# EAGLE design pcb (EAGLE 7.2.0)
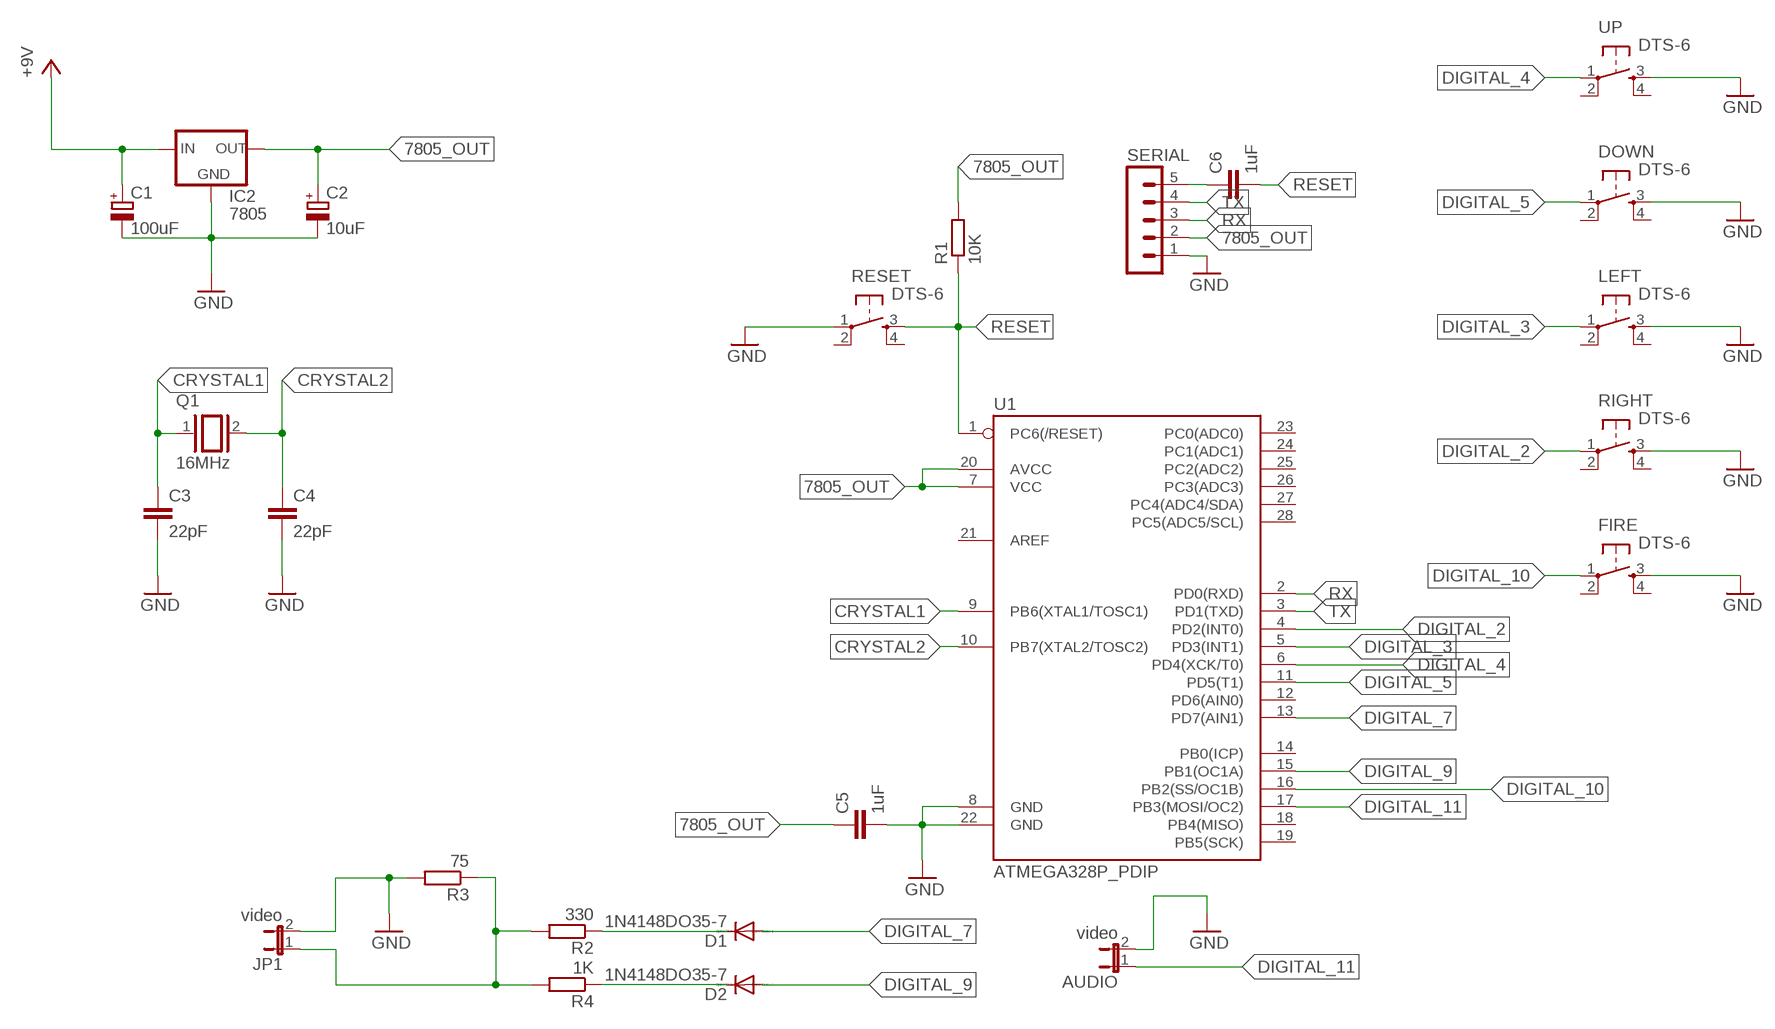
[diagram p0: schematic, sheet 1]

## Parts
AUDIO  video  JP1E  [JP1]
C1  100uF  CPOL-EUE2,5-6E  [E2,5-6E]
C2  10uF  CPOL-EUE2,5-6E  [E2,5-6E]
C3  22pF  C2,5-3  [C2.5-3]
C4  22pF  C2,5-3  [C2.5-3]
C5  1uF  C2,5-3  [C2.5-3]
C6  1uF  C2,5-3  [C2.5-3]
D1  1N4148DO35-7  [DO35-7]
D2  1N4148DO35-7  [DO35-7]
DOWN  DTS-6  [DTS-6]
FIRE  DTS-6  [DTS-6]
IC2  7805  78MXXL  [78MXXL]
JP1  video  JP1E  [JP1]
LEFT  DTS-6  [DTS-6]
Q1  16MHz  XTAL/S  [QS]
R1  10K  R-EU_0204/5  [0204/5]
R2  330  R-EU_0204/5  [0204/5]
R3  75  R-EU_0204/5  [0204/5]
R4  1K  R-EU_0204/5  [0204/5]
RESET  DTS-6  [DTS-6]
RIGHT  DTS-6  [DTS-6]
SERIAL  MA05-1  [MA05-1]
U1  ATMEGA328P_PDIP  [DIL28-3]
UP  DTS-6  [DTS-6]

## Nets
7805_OUT: C2.+ C5.1 IC2.OUT R1.2 SERIAL.2 U1.7(VCC) U1.20(AVCC)
CRYSTAL1: C3.1 Q1.1 U1.9(PB6(XTAL1/TOSC1))
CRYSTAL2: C4.1 Q1.2 U1.10(PB7(XTAL2/TOSC2))
DIGITAL_2: RIGHT.1 U1.4(PD2(INT0))
DIGITAL_3: LEFT.1 U1.5(PD3(INT1))
DIGITAL_4: U1.6(PD4(XCK/T0)) UP.1
DIGITAL_5: DOWN.1 U1.11(PD5(T1))
DIGITAL_7: D1.A U1.13(PD7(AIN1))
DIGITAL_9: D2.A U1.15(PB1(OC1A))
DIGITAL_10: FIRE.1 U1.16(PB2(SS/OC1B))
DIGITAL_11: AUDIO.1 U1.17(PB3(MOSI/OC2))
GND: AUDIO.2 C1.- C2.- C3.2 C4.2 C5.2 DOWN.3 FIRE.3 IC2.GND JP1.2 LEFT.3 R3.2 RESET.1 RIGHT.3 SERIAL.1 U1.8(GND) U1.22(GND) UP.3
N$2: D1.C R2.1
N$3: D2.C R4.1
N$4: JP1.1 R2.2 R3.1 R4.2
N$8: C6.1 SERIAL.5
RESET: C6.2 R1.1 RESET.3 U1.1(PC6(/RESET))
RX: SERIAL.3 U1.2(PD0(RXD))
TX: SERIAL.4 U1.3(PD1(TXD))
VCC: C1.+ IC2.IN ; supply symbol labelled +9V
Unconnected: DOWN.2 DOWN.4 FIRE.2 FIRE.4 LEFT.2 LEFT.4 RESET.2 RESET.4 RIGHT.2 RIGHT.4 U1.12(PD6(AIN0)) U1.14(PB0(ICP)) U1.18(PB4(MISO)) U1.19(PB5(SCK)) U1.21(AREF) U1.23(PC0(ADC0)) U1.24(PC1(ADC1)) U1.25(PC2(ADC2)) U1.26(PC3(ADC3)) U1.27(PC4(ADC4/SDA)) U1.28(PC5(ADC5/SCL)) UP.2 UP.4

## Library data of the parts
AUDIO JP1 = jumper:JP1E: JUMPER
C1 C2 = rcl:CPOL-EU: POLARIZED CAPACITOR, European symbol
C3-C6 = capacitor-wima:C: CAPACITOR naming: grid - package width
D1 D2 = diode:1N4148: DIODE high speed (Philips)
DOWN FIRE LEFT RESET RIGHT UP = switch-tact:DTS-6
IC2 = v-reg:78MXXL: VOLTAGE REGULATOR
Q1 = special:XTAL/S: CRYSTAL
R1-R4 = resistor:R-EU_: RESISTOR, European symbol
SERIAL = con-lstb:MA05-1: PIN HEADER; OC_FARNELL: unknown; OC_NEWARK: unknown
U1 = SparkFun-DigitalIC:ATMEGA328P_PDIP: uC used in the Arduino 32kb flash, 1k EEPROM, 2k SRAM This is the through-hole version of this chip.

## Board
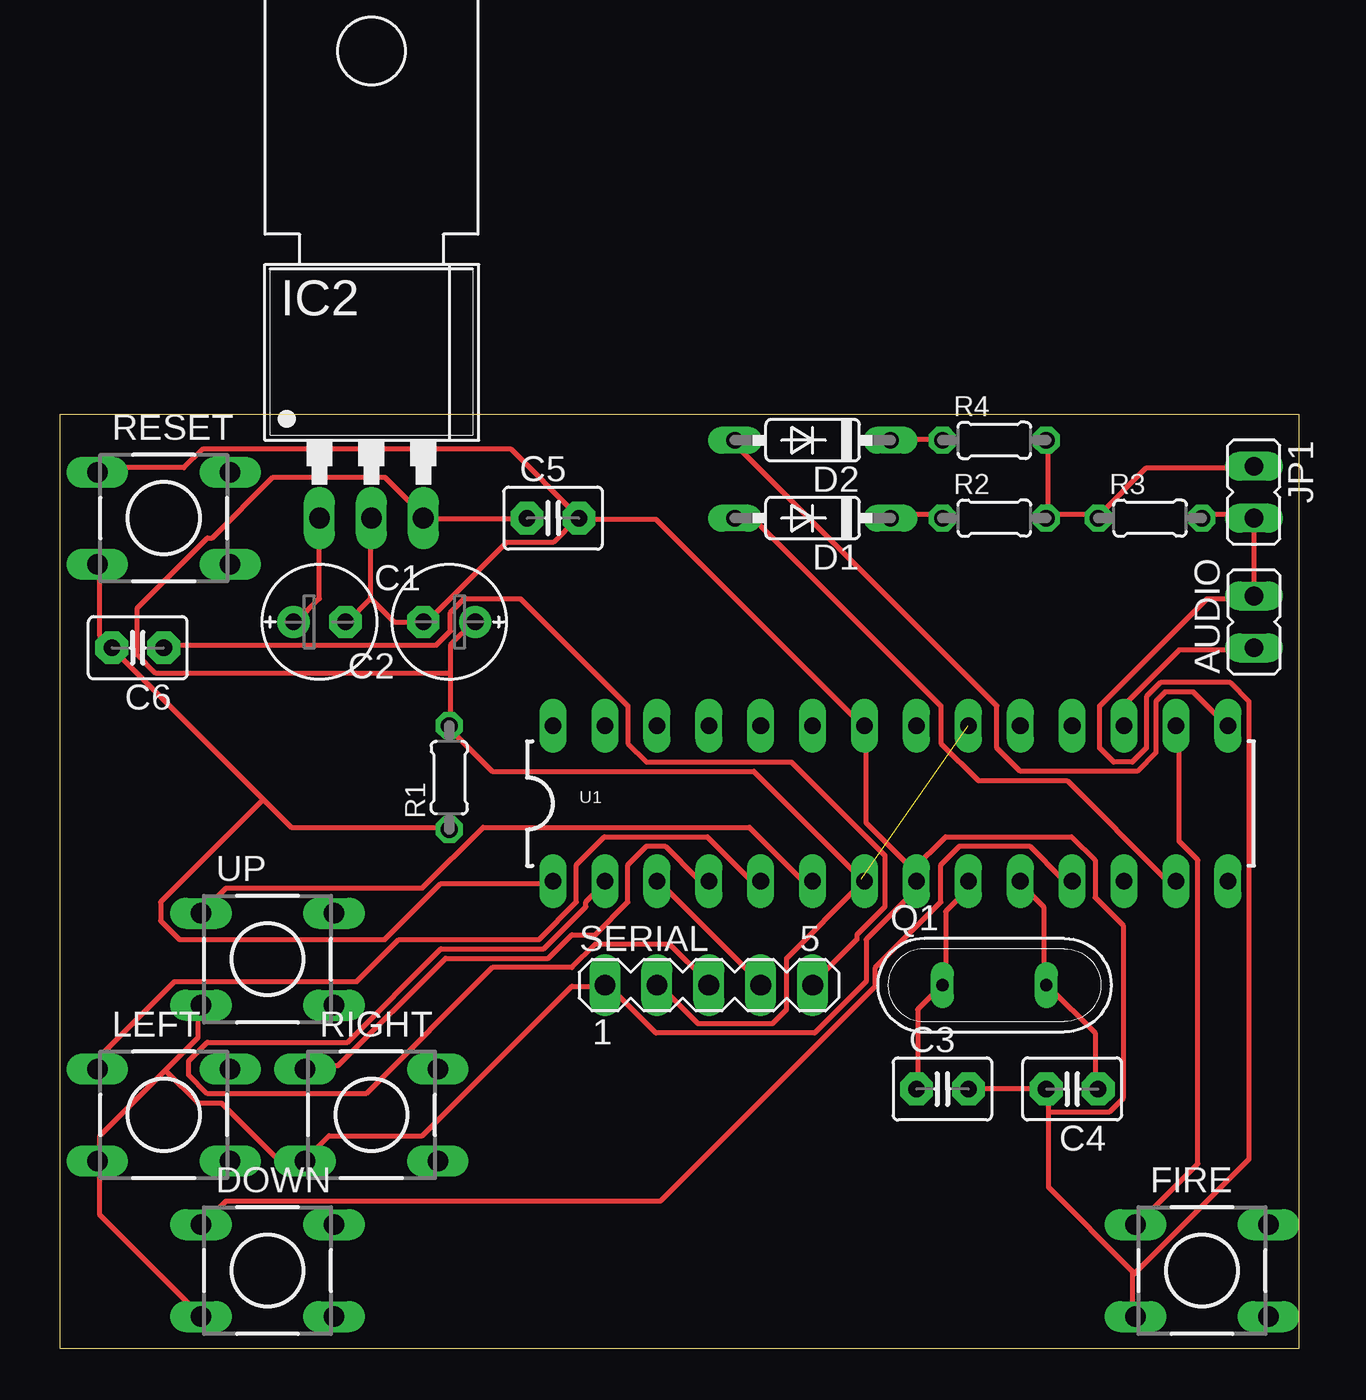
[diagram p1: board, top side]

Size 60.63 x 45.71 mm. Coordinates in mm from the lower left corner, seen from the top.
Outline: 0,0 60.63,0 60.63,45.71 0,45.71 0,0
Copper layers (1*16): Top 0.035mm / dielectric 1.5mm / Bottom 0.035mm
Design rules "default": minimum track width 10mil, minimum drill 24mil, track to track 8mil, track to pad 8mil, pad to pad 8mil, via to via 8mil, smd to smd 8mil, copper to edge 40mil, drill to drill 8mil, minimum pad ring 10mil, minimum via ring 8mil, stop-mask expansion 4mil, vias tented up to drill 0mil, thermal gap 10mil

### Footprints (pad centres in the part's own frame; a part is rotated, then mirrored left to right if it is on the bottom)
JP1 = drill 0.914 long: 1 0,-1.27; 2 0,1.27
E2,5-6E = drill 0.813 pad 1.575: + -1.27,0 | drill 0.813 pad 1.575 octagon: - 1.27,0
C2.5-3 = drill 0.813 pad 1.6 octagon: 1 -1.27,0; 2 1.27,0
DO35-7 = drill 0.813 long: A 3.81,0; C -3.81,0
DTS-6 = drill 1 long: 1 -3.25,2.25; 2 3.25,2.25; 3 -3.25,-2.25; 4 3.25,-2.25
78MXXL = drill 1.016 long: GND 0,-5.08; IN -2.54,-5.08; OUT 2.54,-5.08 | hole 3.302: 0,17.78
QS = drill 0.61 long: 1 -2.54,0; 2 2.54,0
0204/5 = drill 0.813 octagon: 1 -2.54,0; 2 2.54,0
MA05-1 = drill 1.016 long: 1 -5.08,0; 2 -2.54,0; 3 0,0; 4 2.54,0; 5 5.08,0
DIL28-3 = drill 0.813 long: 1 -16.51,-3.81; 2 -13.97,-3.81; 3 -11.43,-3.81; 4 -8.89,-3.81; 5 -6.35,-3.81; 6 -3.81,-3.81; 7 -1.27,-3.81; 8 1.27,-3.81; 9 3.81,-3.81; 10 6.35,-3.81; 11 8.89,-3.81; 12 11.43,-3.81; 13 13.97,-3.81; 14 16.51,-3.81; 15 16.51,3.81; 16 13.97,3.81; 17 11.43,3.81; 18 8.89,3.81; 19 6.35,3.81; 20 3.81,3.81; 21 1.27,3.81; 22 -1.27,3.81; 23 -3.81,3.81; 24 -6.35,3.81; 25 -8.89,3.81; 26 -11.43,3.81; 27 -13.97,3.81; 28 -16.51,3.81

### Placement (x,y rotation side)
AUDIO  58.42,35.56 0 top
C1  12.7,35.56 0 top
C2  19.05,35.56 180 top
C3  43.18,12.7 0 top
C4  49.53,12.7 180 top
C5  24.13,40.64 0 top
C6  3.81,34.29 180 top
D1  36.83,40.64 180 top
D2  36.83,44.45 180 top
DOWN  10.16,3.81 0 top
FIRE  55.88,3.81 0 top
IC2  15.24,45.72 0 top
JP1  58.42,41.91 180 top
LEFT  5.08,11.43 0 top
Q1  45.72,17.78 0 top
R1  19.05,27.94 90 top
R2  45.72,40.64 0 top
R3  53.34,40.64 0 top
R4  45.72,44.45 0 top
RESET  5.08,40.64 0 top
RIGHT  15.24,11.43 0 top
SERIAL  31.75,17.78 0 top
U1  40.64,26.67 0 top
UP  10.16,19.05 0 top

### Tracks (layer width: path | path; a pad name or v marks a point on that pad's centre or on a via)
7805_OUT  (1 unrouted)
  Top 0.254: SERIAL.2 29.39,17.73 31.22,15.9 34.87,15.9 35.56,16.59 35.56,19.1 39.22,22.76 U1.7 39.22,22.99 33.96,28.25 21.16,28.25 19.1,30.3 R1.2 19.1,30.53 19.1,33.05 | C5.1 22.76,40.59 17.96,40.59 IC2.OUT 17.73,40.82 15.9,42.65 10.41,42.65 7.44,39.68 7.21,39.68 3.79,36.25 3.79,33.96 4.7,33.05 19.1,33.05 | 19.1,33.05 19.1,34.42 20.24,35.56 C2.+
CRYSTAL1
  Top 0.254: U1.9 44.25,22.76 44.25,22.3 43.33,21.39 43.33,17.96 Q1.1 43.1,17.73 41.96,16.59 41.96,12.7 C3.1
CRYSTAL2
  Top 0.254: U1.10 46.99,22.76 48.13,21.61 48.13,17.96 Q1.2 48.36,17.73 50.65,15.44 50.65,12.7 C4.1
DIGITAL_2
  Top 0.254: U1.4 31.67,22.99 31.22,22.99 29.62,24.59 28.7,24.59 27.79,23.67 27.79,21.84 26.19,20.24 25.04,20.24 23.9,19.1 18.87,19.1 13.61,13.84 12.01,13.84 RIGHT.1
DIGITAL_3
  Top 0.254: U1.5 34.19,22.99 33.73,22.99 31.67,25.04 26.64,25.04 25.27,23.67 25.27,21.84 23.44,20.02 16.59,20.02 14.53,17.96 5.61,17.96 1.96,14.3 1.96,13.84 LEFT.1
DIGITAL_4
  Top 0.254: U1.6 36.7,22.99 36.25,22.99 33.73,25.5 20.7,25.5 17.73,22.53 8.13,22.53 6.98,21.39 UP.1
DIGITAL_5
  Top 0.254: U1.11 49.51,22.99 49.05,22.99 47.45,24.59 44.02,24.59 43.1,23.67 43.1,21.84 39.9,18.64 39.9,17.73 29.39,7.21 8.13,7.21 6.98,6.07 DOWN.1
DIGITAL_7
  Top 0.254: U1.13 54.53,22.99 54.08,22.99 49.28,27.79 44.93,27.79 43.1,29.62 43.1,31.45 33.96,40.59 33.05,40.59 D1.A
DIGITAL_9
  Top 0.254: D2.A 33.05,44.25 45.85,31.45 45.85,29.39 46.99,28.25 52.71,28.25 53.62,29.16 53.62,31.67 54.08,32.13 55.45,32.13 57.05,30.53 U1.15
DIGITAL_10
  Top 0.254: U1.16 54.76,30.3 54.76,24.82 55.68,23.9 55.68,9.04 52.71,6.07 FIRE.1
DIGITAL_11
  Top 0.254: U1.17 52.25,30.53 52.25,31.67 54.76,34.19 58.42,34.19 AUDIO.1
GND
  Top 0.254: R3.2 55.91,40.82 58.42,40.82 JP1.2 AUDIO.2 58.42,36.7 56.13,36.7 50.88,31.45 50.88,29.39 51.56,28.7 52.48,28.7 53.16,29.39 53.16,31.9 53.85,32.59 57.28,32.59 58.19,31.67 58.19,9.27 52.48,3.56 | 52.48,3.56 52.48,3.79 48.36,7.9 48.36,11.56 | 52.48,3.56 52.48,1.73 FIRE.3 | 48.36,11.56 48.36,12.7 C4.2 C3.2 | DOWN.3 6.76,1.73 1.96,6.53 1.96,9.04 LEFT.3 1.96,9.27 1.96,10.41 5.16,13.61 | 5.16,13.61 6.76,15.21 6.76,16.59 UP.3 | 5.16,13.61 6.76,12.01 7.9,12.01 10.64,9.27 11.79,9.27 RIGHT.3 12.01,9.27 13.16,10.41 17.73,10.41 25.04,17.73 26.64,17.73 SERIAL.1 26.87,17.73 29.16,15.44 36.93,15.44 39.45,17.96 39.45,20.02 41.73,22.3 41.73,22.76 U1.8 | 15.21,36.7 15.21,40.59 IC2.GND | 15.21,36.7 14.07,35.56 C1.- | 15.21,36.7 16.36,35.56 C2.- 17.96,35.56 21.84,39.45 24.13,39.45 25.27,40.59 C5.2 | 41.73,23.44 39.45,25.73 39.45,30.3 U1.22 39.22,30.53 29.16,40.59 25.5,40.59 C5.2 | 41.73,23.44 41.73,22.99 U1.8 | RESET.1 1.96,43.1 6.07,43.1 6.98,44.02 22.07,44.02 25.27,40.82 C5.2 | 48.36,11.56 51.33,11.56 52.02,12.24 52.02,20.7 50.65,22.07 50.65,23.9 49.51,25.04 43.33,25.04 41.73,23.44 | 41.73,23.44 U1.8
N$2
  Top 0.254: D1.C 40.82,40.82 43.1,40.82 R2.1
N$3
  Top 0.254: D2.C 40.82,44.48 43.1,44.48 R4.1
N$4
  Top 0.254: 48.36,40.82 50.65,40.82 R3.1 50.88,40.82 53.16,43.1 58.42,43.1 JP1.1 | 48.36,40.82 48.36,44.25 R4.2 | 48.36,40.82 R2.2
N$8
  Top 0.254: SERIAL.5 36.93,17.96 38.99,20.02 38.99,20.24 40.36,21.61 40.36,24.13 35.79,28.7 28.7,28.7 27.79,29.62 27.79,31.45 22.53,36.7 19.79,36.7 19.1,36.02 19.1,35.1 18.41,34.42 5.16,34.42 C6.1
RESET
  Top 0.254: 9.96,26.87 C6.2 1.96,34.87 1.96,38.3 RESET.3 | 9.96,26.87 11.33,25.5 18.87,25.5 R1.1 | 9.96,26.87 4.93,21.84 4.93,20.93 5.84,20.02 15.9,20.02 18.64,22.76 24.13,22.76 U1.1
RX
  Top 0.254: U1.2 26.64,22.76 25.73,21.84 25.73,21.61 23.67,19.56 18.64,19.56 14.07,14.99 7.21,14.99 6.3,14.07 6.3,13.39 7.21,12.47 14.99,12.47 21.16,18.64 25.04,18.64 26.19,19.79 29.84,19.79 31.67,17.96 SERIAL.3
TX
  Top 0.254: U1.3 29.39,22.76 34.19,17.96 SERIAL.4
VCC
  Top 0.254: IC2.IN 12.7,36.7 11.56,35.56 C1.+